# EasyEDA Pro project ProPrj_超级电容模组v1.0_2025-02-24.epro

# Schematic Schematic1
Board Name: Board1
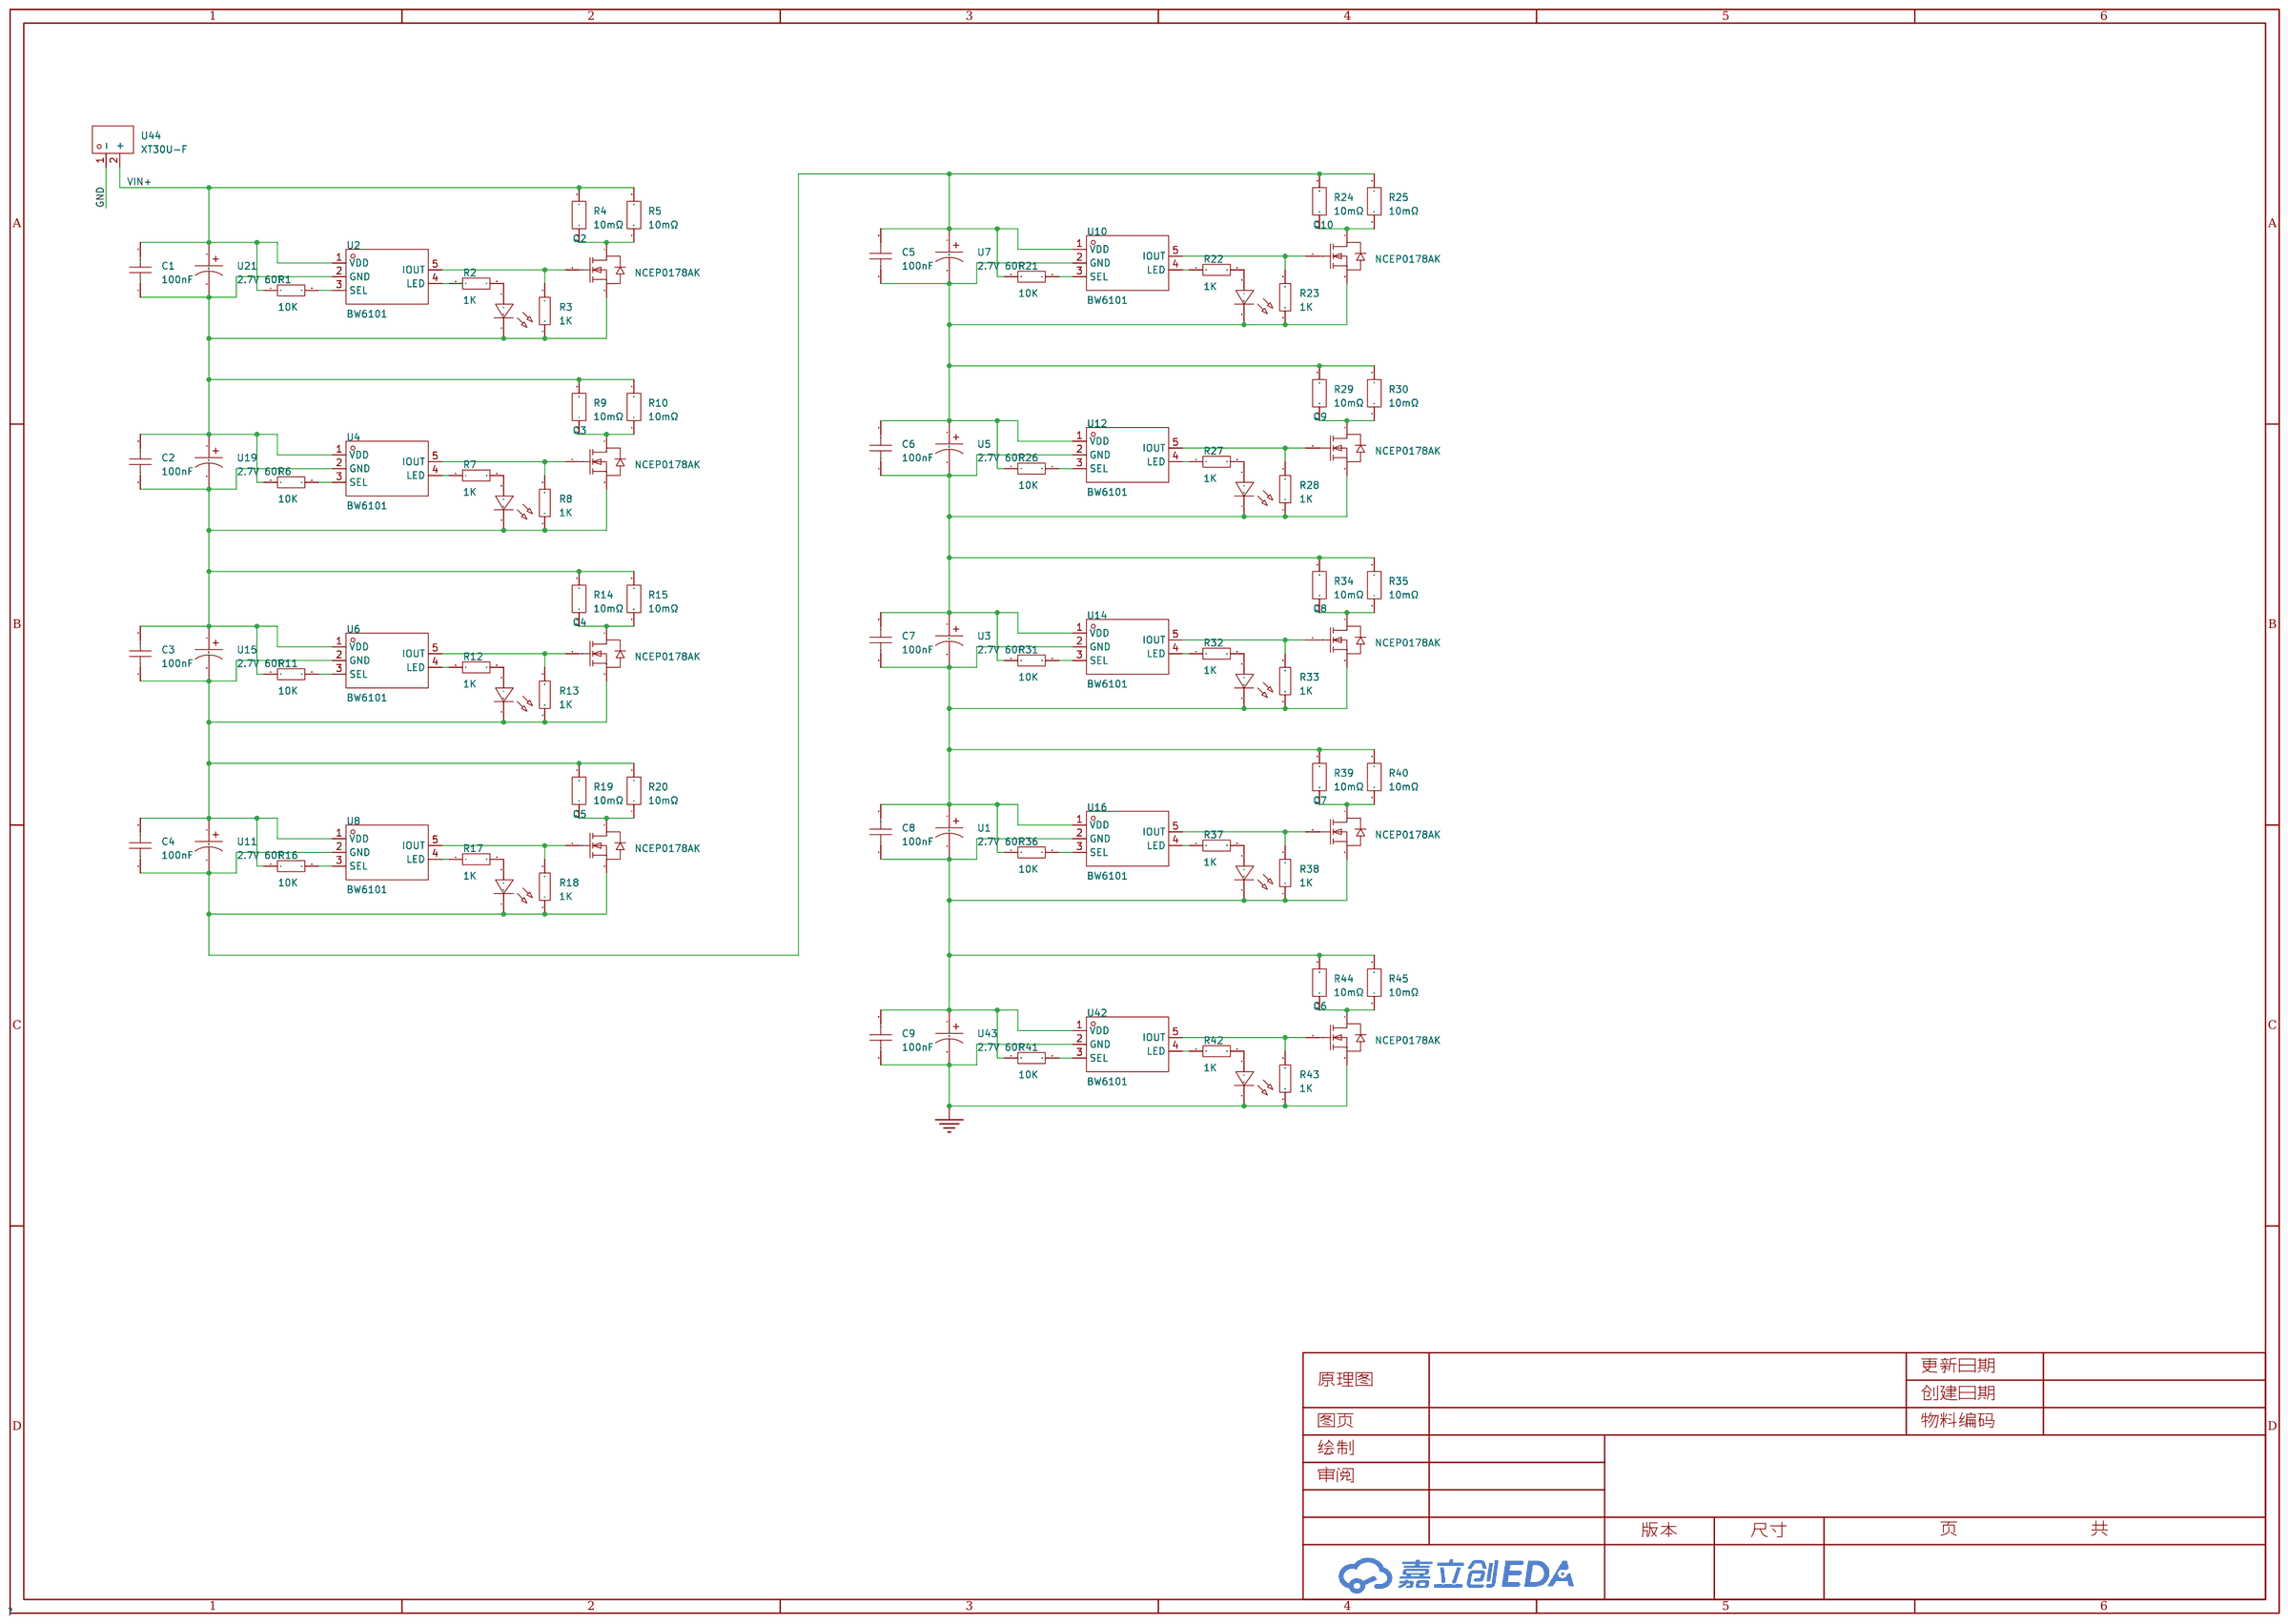
[diagram p0: schematic sheet]

## Parts
C1  100nF  [C0805]
C2  100nF  [C0805]
C3  100nF  [C0805]
C4  100nF  [C0805]
C5  100nF  [C0805]
C6  100nF  [C0805]
C7  100nF  [C0805]
C8  100nF  [C0805]
C9  100nF  [C0805]
LED1  -  [LED_0603]
LED2  -  [LED_0603]
LED3  -  [LED_0603]
LED4  -  [LED_0603]
LED5  -  [LED_0603]
LED6  -  [LED_0603]
LED7  -  [LED_0603]
LED8  -  [LED_0603]
LED9  -  [LED_0603]
Q2  NCEP0178AK  [TO-252-2_L6.5-W6.1-P4.58-LS10.0-TL]
Q3  NCEP0178AK  [TO-252-2_L6.5-W6.1-P4.58-LS10.0-TL]
Q4  NCEP0178AK  [TO-252-2_L6.5-W6.1-P4.58-LS10.0-TL]
Q5  NCEP0178AK  [TO-252-2_L6.5-W6.1-P4.58-LS10.0-TL]
Q6  NCEP0178AK  [TO-252-2_L6.5-W6.1-P4.58-LS10.0-TL]
Q7  NCEP0178AK  [TO-252-2_L6.5-W6.1-P4.58-LS10.0-TL]
Q8  NCEP0178AK  [TO-252-2_L6.5-W6.1-P4.58-LS10.0-TL]
Q9  NCEP0178AK  [TO-252-2_L6.5-W6.1-P4.58-LS10.0-TL]
Q10  NCEP0178AK  [TO-252-2_L6.5-W6.1-P4.58-LS10.0-TL]
R1  10K  [R0603]
R2  1K  [R0603]
R3  1K  [R0603]
R4  10mΩ  [RES-SMD_L6.4-W3.2-R2512]
R5  10mΩ  [RES-SMD_L6.4-W3.2-R2512]
R6  10K  [R0603]
R7  1K  [R0603]
R8  1K  [R0603]
R9  10mΩ  [RES-SMD_L6.4-W3.2-R2512]
R10  10mΩ  [RES-SMD_L6.4-W3.2-R2512]
R11  10K  [R0603]
R12  1K  [R0603]
R13  1K  [R0603]
R14  10mΩ  [RES-SMD_L6.4-W3.2-R2512]
R15  10mΩ  [RES-SMD_L6.4-W3.2-R2512]
R16  10K  [R0603]
R17  1K  [R0603]
R18  1K  [R0603]
R19  10mΩ  [RES-SMD_L6.4-W3.2-R2512]
R20  10mΩ  [RES-SMD_L6.4-W3.2-R2512]
R21  10K  [R0603]
R22  1K  [R0603]
R23  1K  [R0603]
R24  10mΩ  [RES-SMD_L6.4-W3.2-R2512]
R25  10mΩ  [RES-SMD_L6.4-W3.2-R2512]
R26  10K  [R0603]
R27  1K  [R0603]
R28  1K  [R0603]
R29  10mΩ  [RES-SMD_L6.4-W3.2-R2512]
R30  10mΩ  [RES-SMD_L6.4-W3.2-R2512]
R31  10K  [R0603]
R32  1K  [R0603]
R33  1K  [R0603]
R34  10mΩ  [RES-SMD_L6.4-W3.2-R2512]
R35  10mΩ  [RES-SMD_L6.4-W3.2-R2512]
R36  10K  [R0603]
R37  1K  [R0603]
R38  1K  [R0603]
R39  10mΩ  [RES-SMD_L6.4-W3.2-R2512]
R40  10mΩ  [RES-SMD_L6.4-W3.2-R2512]
R41  10K  [R0603]
R42  1K  [R0603]
R43  1K  [R0603]
R44  10mΩ  [RES-SMD_L6.4-W3.2-R2512]
R45  10mΩ  [RES-SMD_L6.4-W3.2-R2512]
U1  2.7V 60F  [CAP-TH_BD18.0-P7.50-D0.8-FD]
U2  BW6101  [SOT-23-5_L2.9-W1.6-P0.95-LS2.8-BL]
U3  2.7V 60F  [CAP-TH_BD18.0-P7.50-D0.8-FD]
U4  BW6101  [SOT-23-5_L2.9-W1.6-P0.95-LS2.8-BL]
U5  2.7V 60F  [CAP-TH_BD18.0-P7.50-D0.8-FD]
U6  BW6101  [SOT-23-5_L2.9-W1.6-P0.95-LS2.8-BL]
U7  2.7V 60F  [CAP-TH_BD18.0-P7.50-D0.8-FD]
U8  BW6101  [SOT-23-5_L2.9-W1.6-P0.95-LS2.8-BL]
U10  BW6101  [SOT-23-5_L2.9-W1.6-P0.95-LS2.8-BL]
U11  2.7V 60F  [CAP-TH_BD18.0-P7.50-D0.8-FD]
U12  BW6101  [SOT-23-5_L2.9-W1.6-P0.95-LS2.8-BL]
U14  BW6101  [SOT-23-5_L2.9-W1.6-P0.95-LS2.8-BL]
U15  2.7V 60F  [CAP-TH_BD18.0-P7.50-D0.8-FD]
U16  BW6101  [SOT-23-5_L2.9-W1.6-P0.95-LS2.8-BL]
U19  2.7V 60F  [CAP-TH_BD18.0-P7.50-D0.8-FD]
U21  2.7V 60F  [CAP-TH_BD18.0-P7.50-D0.8-FD]
U42  BW6101  [SOT-23-5_L2.9-W1.6-P0.95-LS2.8-BL]
U43  2.7V 60F  [CAP-TH_BD18.0-P7.50-D0.8-FD]
U44  XT30U-F  [CONN-TH_XT30U-F]

## Library data of the parts
C1-C9 = CAP_0805: Supplier Footprint: 0805
LED1-LED9 = LED_0603-R: Supplier Footprint: 0603
Q2-Q10 = NCEP0178AK: 类型:N沟道;漏源电压(Vdss):100V;连续漏极电流(Id):78A;功率(Pd):125W;导通电阻(RDS(on)@Vgs,Id):8.5mΩ@10V,39A;阈值电压(Vgs(th)@Id):2.2V@250uA;; LCSC Part Name: N沟道 耐压:100V 电流:78A; Supplier Part: C216784; Manufacturer: NCE(无锡新洁能); Supplier Footprint: TO-252-2(DPAK); JLCPCB Part Class: 扩展库; Datasheet: https://atta.szlcsc.com/upload/public/pdf/source/20180614/C216784_4CC9571F208305EE00914CFFBA9F145C.pdf; Supplier: LCSC; Type: N沟道; Drain Source Voltage (Vdss): 100V; Continuous Drain Current (Id): 78A; Power Dissipation (Pd): 125W; Drain Source On Resistance (RDS(on)@Vgs,Id): 8.5mΩ@10V,39A; Gate Threshold Voltage (Vgs(th)@Id): 2.2V@250uA
R1-R3 R6-R8 R11-R13 R16-R18 R21-R23 R26-R28 R31-R33 R36-R38 R41-R43 = Res_0603: Supplier Footprint: 0603
R4 R5 R9 R10 R14 R15 R19 R20 R24 R25 R29 R30 R34 R35 R39 R40 R44 R45 = HoJLR2512-3W-10mR-1%: 电阻类型:采样电阻;阻值:10mΩ;精度:±1%;功率:3W;安装方式:贴片;; LCSC Part Name: 10mΩ ±1% 3W; Supplier Part: C2903468; Manufacturer: Milliohm(毫欧); Supplier Footprint: 2512; JLCPCB Part Class: 扩展库; Datasheet: https://atta.szlcsc.com/upload/public/pdf/source/20211009/7525CABAB363C979E942C1DD41F1FEF0.pdf; Supplier: LCSC; Type: 采样电阻; Tolerance: ±1%; Power(Watts): 3W; Mounting Sytle: 贴片
U1 U3 U5 U7 U11 U15 U19 U21 U43 = CXHP2R7506R-TWX-M0 2.7V50F: 容值:50F;精度:±20%;额定电压:2.7V;漏电流:110uA@72hrs;等效串联电阻:18mΩ@1kHz;; LCSC Part Name: 50F ±20% 2.7V; Supplier Part: C2925861; Manufacturer: CDA(智烽维); Supplier Footprint: 插件,P=7.5mm; JLCPCB Part Class: 扩展库; Datasheet: https://atta.szlcsc.com/upload/public/pdf/source/20211227/1A134DDAE96ACB50B8B4D21A958B383D.pdf; Supplier: LCSC; Tolerance: ±20%; Rated Voltage: 2.7V; Leakage Current(DCL): 110uA@72hrs; Equivalent Series Resistance(ESR): 18mΩ@1kHz; Lifetime @ Temp: 1500hrs@70℃; Cycle Life Expectancy: 500000次; Operating Temperature: -40℃~+70℃; φD: 18mm; Body Height: 35mm
U2 U4 U6 U8 U10 U12 U14 U16 U42 = BW6101: Supplier Part: C2835089; Supplier Footprint: SOT-23-5L; JLCPCB Part Class: 扩展库; Datasheet: https://atta.szlcsc.com/upload/public/pdf/source/20210707/C2835089_4C01BDF627A2FFA08E7525016E70DE9A.pdf; Supplier: LCSC
U44 = XT30U-F: 类别:-;类型1:-;; LCSC Part Name: AMASS(艾迈斯)轻量版锂电池插头母头 XT30U-F; Supplier Part: C99102; Manufacturer: AMASS(艾迈斯); JLCPCB Part Class: 扩展库; Datasheet: https://atta.szlcsc.com/upload/public/pdf/source/20190916/C428721_B0ECB8C5937139CEFE8736D2D3175B0E.pdf; Supplier: LCSC; Brand: 艾迈斯; Type: 插头; Colour: 黄色; InterfaceType: 母头

## Nets
GND: C9.1 LED9.1(C) Q6.3(S) R43.1 U42.2(GND) U43.2 U44.1(-)
VIN+: C1.2 R1.1 R4.2 R5.2 U2.1(VDD) U21.1 U44.2(+)
$1N3272: C4.1 C5.2 LED4.1(C) Q5.3(S) R18.1 R21.1 R24.2 R25.2 U7.1 U8.2(GND) U10.1(VDD) U11.2
$1N3273: Q5.1(G) R18.2 U8.5(IOUT)
$1N3274: LED4.2(A) R17.2
$1N3278: R17.1 U8.4(LED)
$1N3279: R16.2 U8.3(SEL)
$1N3280: C3.1 C4.2 LED3.1(C) Q4.3(S) R13.1 R16.1 R19.2 R20.2 U6.2(GND) U8.1(VDD) U11.1 U15.2
$1N3281: Q5.4(D) R19.1 R20.1
$1N3294: C2.1 C3.2 LED2.1(C) Q3.3(S) R8.1 R11.1 R14.2 R15.2 U4.2(GND) U6.1(VDD) U15.1 U19.2
$1N3302: R11.2 U6.3(SEL)
$1N3303: LED3.2(A) R12.2
$1N3304: Q4.1(G) R13.2 U6.5(IOUT)
$1N3305: R12.1 U6.4(LED)
$1N3306: Q4.4(D) R14.1 R15.1
$1N3307: Q3.1(G) R8.2 U4.5(IOUT)
$1N3308: LED2.2(A) R7.2
$1N3309: R7.1 U4.4(LED)
$1N3310: R6.2 U4.3(SEL)
$1N3311: C1.1 C2.2 LED1.1(C) Q2.3(S) R3.1 R6.1 R9.2 R10.2 U2.2(GND) U4.1(VDD) U19.1 U21.2
$1N3312: Q3.4(D) R9.1 R10.1
$1N3315: R2.1 U2.4(LED)
$1N3316: Q2.1(G) R3.2 U2.5(IOUT)
$1N3317: LED1.2(A) R2.2
$1N3318: Q2.4(D) R4.1 R5.1
$1N3321: R1.2 U2.3(SEL)
$1N4570: R21.2 U10.3(SEL)
$1N4571: R22.1 U10.4(LED)
$1N4572: LED5.2(A) R22.2
$1N4573: Q10.1(G) R23.2 U10.5(IOUT)
$1N4574: Q10.4(D) R24.1 R25.1
$1N4575: R26.2 U12.3(SEL)
$1N4576: C5.1 C6.2 LED5.1(C) Q10.3(S) R23.1 R26.1 R29.2 R30.2 U5.1 U7.2 U10.2(GND) U12.1(VDD)
$1N4577: R27.1 U12.4(LED)
$1N4578: LED6.2(A) R27.2
$1N4579: Q9.1(G) R28.2 U12.5(IOUT)
$1N4580: Q9.4(D) R29.1 R30.1
$1N4581: R31.2 U14.3(SEL)
$1N4582: R32.1 U14.4(LED)
$1N4583: LED7.2(A) R32.2
$1N4584: Q8.1(G) R33.2 U14.5(IOUT)
$1N4585: Q8.4(D) R34.1 R35.1
$1N4586: R36.2 U16.3(SEL)
$1N4587: C7.1 C8.2 LED7.1(C) Q8.3(S) R33.1 R36.1 R39.2 R40.2 U1.1 U3.2 U14.2(GND) U16.1(VDD)
$1N4588: R37.1 U16.4(LED)
$1N4589: LED8.2(A) R37.2
$1N4590: Q7.1(G) R38.2 U16.5(IOUT)
$1N4591: Q7.4(D) R39.1 R40.1
$1N4592: C6.1 C7.2 LED6.1(C) Q9.3(S) R28.1 R31.1 R34.2 R35.2 U3.1 U5.2 U12.2(GND) U14.1(VDD)
$1N4594: C8.1 C9.2 LED8.1(C) Q7.3(S) R38.1 R41.1 R44.2 R45.2 U1.2 U16.2(GND) U42.1(VDD) U43.1
$1N4955: R41.2 U42.3(SEL)
$1N4957: R42.1 U42.4(LED)
$1N4958: LED9.2(A) R42.2
$1N4959: Q6.1(G) R43.2 U42.5(IOUT)
$1N4960: Q6.4(D) R44.1 R45.1
